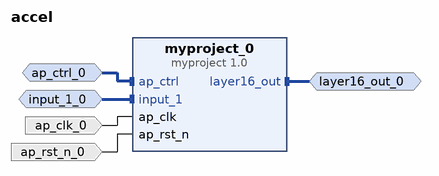
[diagram p0: block diagram of the top level]
# Vivado block design accel, xc7a35tcpg236-1, Vivado 2023.1
create_bd_design accel

create_bd_intf_port -mode Slave -vlnv xilinx.com:interface:axis_rtl:1.0 input_1_0
set_property -dict [list \
  CONFIG.HAS_TKEEP 0 \
  CONFIG.HAS_TLAST 0 \
  CONFIG.HAS_TREADY 1 \
  CONFIG.HAS_TSTRB 0 \
  CONFIG.LAYERED_METADATA undef \
  CONFIG.TDATA_NUM_BYTES 1 \
  CONFIG.TDEST_WIDTH 0 \
  CONFIG.TID_WIDTH 0 \
  CONFIG.TUSER_WIDTH 0 \
] [get_bd_intf_ports input_1_0]
create_bd_intf_port -mode Slave -vlnv xilinx.com:interface:acc_handshake_rtl:1.0 ap_ctrl_0
create_bd_intf_port -mode Master -vlnv xilinx.com:interface:axis_rtl:1.0 layer16_out_0
create_bd_port -dir I -type clk ap_clk_0
create_bd_port -dir I -type rst ap_rst_n_0

create_bd_cell -type ip -vlnv Peter:PilotNet:myproject:1.0 myproject_0

# ---- connections ----

connect_bd_intf_net -intf_net ap_ctrl_0_1 [get_bd_intf_ports ap_ctrl_0] [get_bd_intf_pins myproject_0/ap_ctrl]
connect_bd_intf_net -intf_net input_1_0_1 [get_bd_intf_ports input_1_0] [get_bd_intf_pins myproject_0/input_1]
connect_bd_intf_net [get_bd_intf_ports layer16_out_0] [get_bd_intf_pins myproject_0/layer16_out]
connect_bd_net -net ap_clk_0_1 [get_bd_ports ap_clk_0] [get_bd_pins myproject_0/ap_clk]
connect_bd_net -net ap_rst_n_0_1 [get_bd_ports ap_rst_n_0] [get_bd_pins myproject_0/ap_rst_n]

validate_bd_design
save_bd_design
